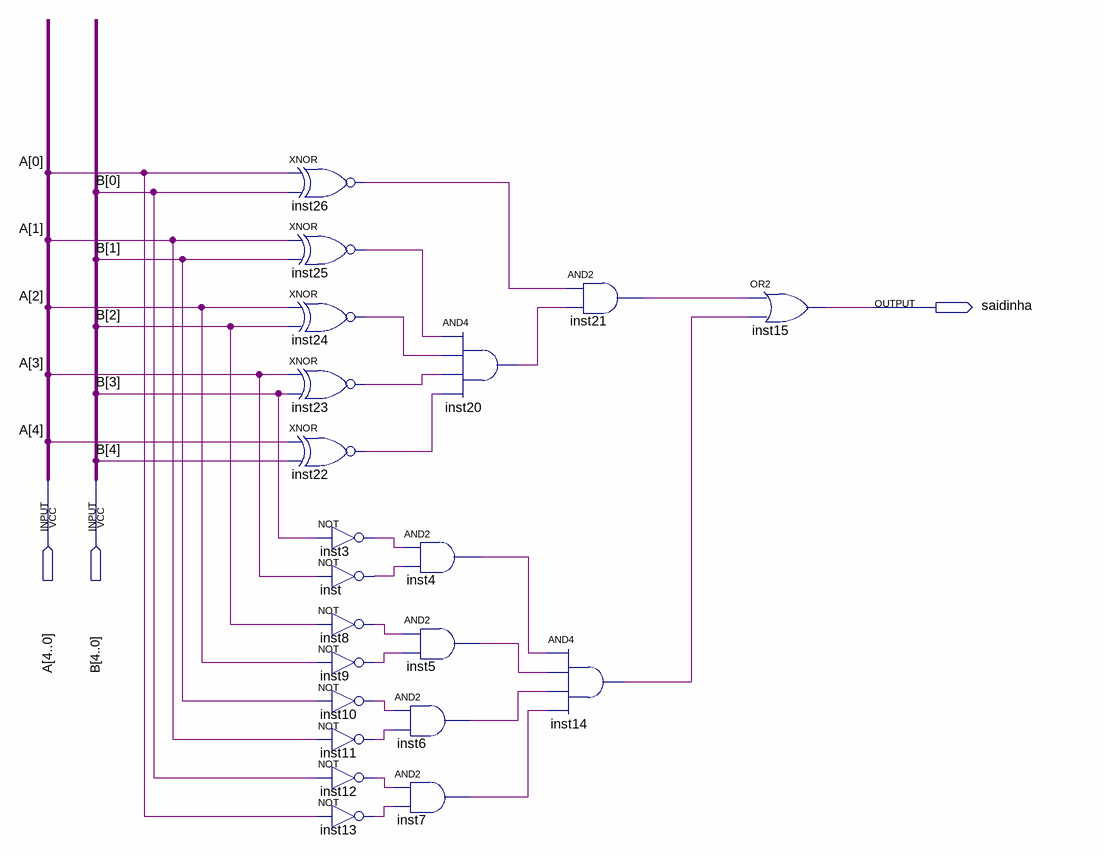
[diagram p0: schematic sheet]
// Quartus schematic comparador.bdf as structural Verilog: 21 symbols, 3 pins
module comparador (
  input  [4:0] A,
  input  [4:0] B,
  output saidinha
);

  wire inst3_out, inst4_out, inst5_out, inst6_out, inst7_out, inst8_out, inst9_out, inst10_out, inst11_out,
       inst12_out, inst13_out, inst14_out, inst20_out, inst21_out, inst22_out, inst23_out, inst24_out,
       inst25_out, inst26_out, inst_out;

  xnor inst26 (inst26_out, A[0], B[0]);
  xnor inst25 (inst25_out, A[1], B[1]);
  xnor inst24 (inst24_out, A[2], B[2]);
  xnor inst23 (inst23_out, A[3], B[3]);
  xnor inst22 (inst22_out, A[4], B[4]);
  not inst3 (inst3_out, B[3]);
  not inst (inst_out, A[3]);
  not inst8 (inst8_out, B[2]);
  not inst9 (inst9_out, A[2]);
  not inst10 (inst10_out, B[1]);
  not inst11 (inst11_out, A[1]);
  not inst12 (inst12_out, B[0]);
  not inst13 (inst13_out, A[0]);
  and inst4 (inst4_out, inst3_out, inst_out);
  and inst5 (inst5_out, inst8_out, inst9_out);
  and inst6 (inst6_out, inst10_out, inst11_out);
  and inst7 (inst7_out, inst12_out, inst13_out);
  and inst20 (inst20_out, inst25_out, inst24_out, inst23_out, inst22_out);
  and inst21 (inst21_out, inst26_out, inst20_out);
  and inst14 (inst14_out, inst4_out, inst5_out, inst6_out, inst7_out);
  or inst15 (saidinha, inst21_out, inst14_out);
endmodule
